# EAGLE design 2 channel DIP (EAGLE 6.5.0)
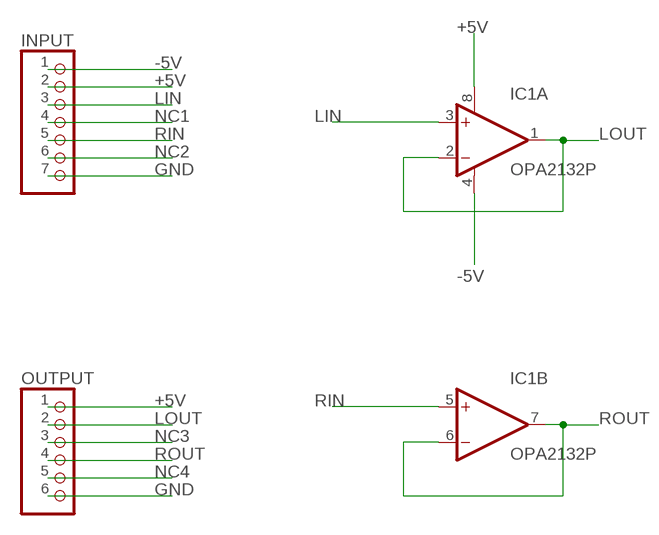
[diagram p0: schematic, sheet 1]

## Parts
IC1  OPA2132P  [DIL08]
INPUT  PINHD-1X7  [1X07]
OUTPUT  PINHD-1X6  [1X06]

## Nets
+5V: IC1.8(A:V+) INPUT.2 OUTPUT.1
-5V: IC1.4(A:V-) INPUT.1
GND: INPUT.7 OUTPUT.6
LIN: IC1.3(A:+IN) INPUT.3
LOUT: IC1.1(A:OUT) IC1.2(A:-IN) OUTPUT.2
NC1: INPUT.4
NC2: INPUT.6
NC3: OUTPUT.3
NC4: OUTPUT.5
RIN: IC1.5(B:+IN) INPUT.5
ROUT: IC1.6(B:-IN) IC1.7(B:OUT) OUTPUT.4

## Library data of the parts
IC1 = burr-brown:OPA2132: High Speed FET-Input Operational Amplifiers< Product Folder:OPA2132; MPN: OPA2132P; OC_FARNELL: 1212432; OC_NEWARK: 47P7461
INPUT = pinhead:PINHD-1X7: PIN HEADER
OUTPUT = pinhead:PINHD-1X6: PIN HEADER

## Board
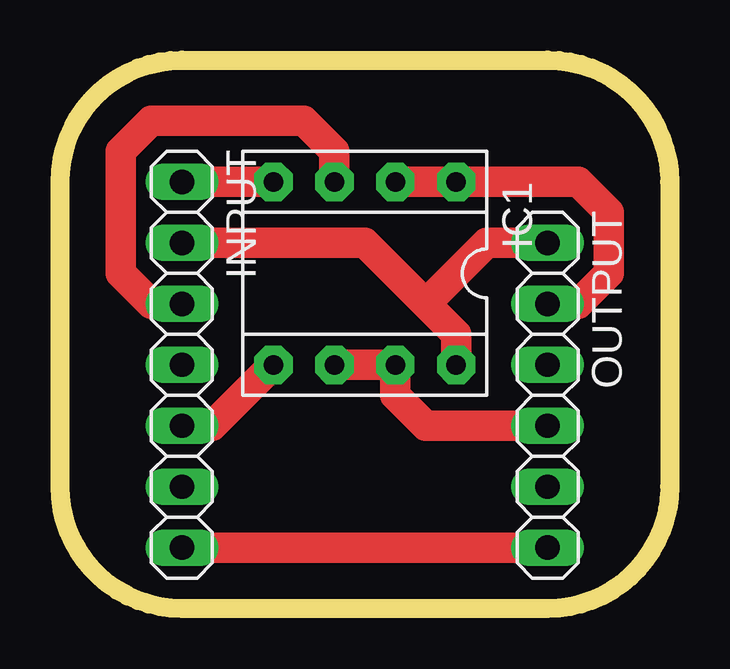
[diagram p1: board, top side]

Size 25.4 x 22.86 mm. Coordinates in mm from the lower left corner, seen from the top.
Outline: 0,5.08 0,17.78 arc-90 5.08,22.86 20.32,22.86 arc-90 25.4,17.78 25.4,5.08 arc-90 20.32,0 5.08,0 arc-90 0,5.08
Copper layers (1*16): Top 0.035mm / dielectric 1.5mm / Bottom 0.035mm
Design rules "default": minimum track width 10mil, minimum drill 24mil, track to track 8mil, track to pad 8mil, pad to pad 8mil, via to via 8mil, smd to smd 8mil, copper to edge 40mil, drill to drill 8mil, minimum pad ring 10mil, minimum via ring 8mil, stop-mask expansion 4mil, vias tented up to drill 0mil, thermal gap 10mil

### Footprints (pad centres in the part's own frame; a part is rotated, then mirrored left to right if it is on the bottom)
DIL08 = drill 0.813 pad 1.6 octagon: 1 -3.81,-3.81; 2 -1.27,-3.81; 3 1.27,-3.81; 4 3.81,-3.81; 5 3.81,3.81; 6 1.27,3.81; 7 -1.27,3.81; 8 -3.81,3.81
1X07 = drill 1.016 long: 1 -7.62,0; 2 -5.08,0; 3 -2.54,0; 4 0,0; 5 2.54,0; 6 5.08,0; 7 7.62,0
1X06 = drill 1.016 long: 1 -6.35,0; 2 -3.81,0; 3 -1.27,0; 4 1.27,0; 5 3.81,0; 6 6.35,0

### Placement (x,y rotation side)
IC1  12.7,13.97 180 top
INPUT  5.08,10.16 270 top
OUTPUT  20.32,8.89 270 top

### Tracks (layer width: path | path; a pad name or v marks a point on that pad's centre or on a via)
+5V
  Top 1.27: INPUT.2 12.7,15.24 15.24,12.7 | 15.24,12.7 16.51,11.43 IC1.8 | OUTPUT.1 17.78,15.24 15.24,12.7
-5V
  Top 1.27: INPUT.1 IC1.4
GND
  Top 1.27: OUTPUT.6 INPUT.7
LIN
  Top 1.27: IC1.3 11.43,19.05 10.16,20.32 3.81,20.32 2.54,19.05 2.54,13.97 3.81,12.7 INPUT.3
LOUT
  Top 1.27: OUTPUT.2 21.59,12.7 22.86,13.97 22.86,16.51 21.59,17.78 IC1.1 IC1.2
RIN
  Top 1.27: INPUT.5 6.35,7.62 IC1.5
ROUT
  Top 1.27: IC1.6 IC1.7 13.97,8.89 15.24,7.62 OUTPUT.4